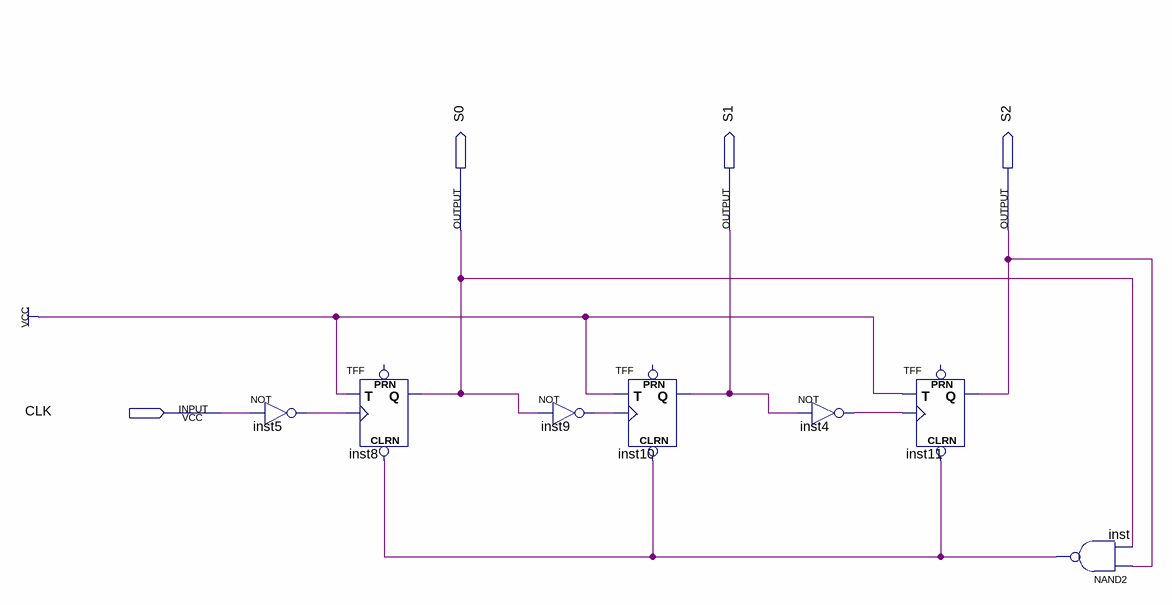
[diagram p0: schematic sheet]
// Quartus schematic contador0-5.bdf as structural Verilog: 7 symbols, 4 pins
module \contador0-5  (
  input  CLK,
  output S0,
  output S1,
  output S2
);

  wire inst4_out, inst5_out, inst9_out, inst_out;

  not inst5 (inst5_out, CLK);
  TFF inst8 (.CLRN(inst_out), .T(1'b1), .CLK(inst5_out), .Q(S0));  // open: PRN
  not inst9 (inst9_out, S0);
  TFF inst10 (.CLRN(inst_out), .T(1'b1), .CLK(inst9_out), .Q(S1));  // open: PRN
  not inst4 (inst4_out, S1);
  TFF inst11 (.CLRN(inst_out), .T(1'b1), .CLK(inst4_out), .Q(S2));  // open: PRN
  nand inst (inst_out, S2, S0);
endmodule
